# EAGLE schematic ESC-stub (EAGLE 6.1)
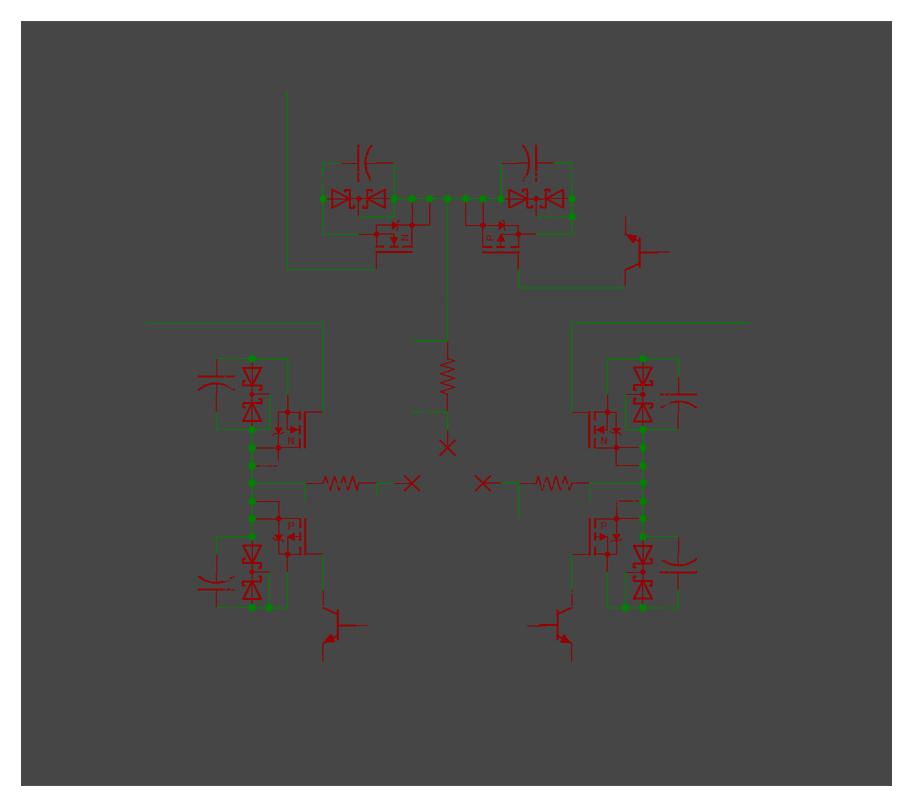
[diagram p0: schematic, sheet 1]

## Parts
C9  C-USC0402K  [C0402K]
C10  C-USC0402K  [C0402K]
C11  C-USC0402K  [C0402K]
C12  C-USC0402K  [C0402K]
C13  C-USC0402K  [C0402K]
C14  C-USC0402K  [C0402K]
D2  BAS40-05  [SOT23]
D3  BAS40-05  [SOT23]
D4  BAS40-05  [SOT23]
D5  BAS40-05  [SOT23]
D6  BAS40-05  [SOT23]
D7  BAS40-05  [SOT23]
PAD1  WIREPADSMD5-2,5  [5-2,5]
PAD2  WIREPADSMD5-2,5  [5-2,5]
PAD3  WIREPADSMD5-2,5  [5-2,5]
R2  R-US_R2512W  [R2512W]
R3  R-US_R2512W  [R2512W]
R4  R-US_R2512W  [R2512W]
U$14  IRF7309Q  [SO-8]
U$16  IRF7309Q  [SO-8]
U$18  IRF7309Q  [SO-8]
U$19  2PC4617  [SOT-416]
U$20  2PC4617  [SOT-416]
U$21  2PC4617  [SOT-416]

## Nets
N$19: U$14.4(P-G) U$19.P$3
N$20: U$14.2(N-G)
N$21: U$18.2(N-G)
N$22: U$16.4(P-G) U$20.P$3
N$23: U$16.2(N-G)
N$24: U$18.4(P-G) U$21.P$3
N$25: C9.2 C10.2 D2.1(A1) D2.3(C) D3.1(A1) R2.1 U$14.5(P-D$1) U$14.6(P-D$2) U$14.7(N-D$2) U$14.8(N-D$1)
N$26: PAD1.1(P) R2.2
N$27: PAD2.1(P) R3.1
N$28: PAD3.1(P) R4.2
N$29: C9.1 D2.2(A2) U$14.1(N-S)
N$30: C10.1 D3.2(A2) D3.3(C) U$14.3(P-S)
N$31: C13.1 D6.2(A2) U$18.1(N-S)
N$32: C14.1 D7.2(A2) D7.3(C) U$18.3(P-S)
N$33: C11.1 D4.2(A2) U$16.1(N-S)
N$34: C12.1 D5.2(A2) D5.3(C) U$16.3(P-S)
N$35: C13.2 C14.2 D6.1(A1) D6.3(C) D7.1(A1) R4.1 U$18.5(P-D$1) U$18.6(P-D$2) U$18.7(N-D$2) U$18.8(N-D$1)
N$36: C11.2 C12.2 D4.1(A1) D4.3(C) D5.1(A1) R3.2 U$16.5(P-D$1) U$16.6(P-D$2) U$16.7(N-D$2) U$16.8(N-D$1)
Unconnected: U$19.P$1 U$19.P$2 U$20.P$1 U$20.P$2 U$21.P$1 U$21.P$2

## Notes on the sheet
- Source
- M

## Library data of the parts
C9-C14 = rcl:C-US: CAPACITOR, American symbol
D2-D7 = diode:BAS40-05: Silicon Schottky Diodes General-purpose diode for high-speed switching
PAD1-PAD3 = wirepad:WIREPAD: Wire PAD connect wire on PCB
R2-R4 = rcl:R-US_: RESISTOR, American symbol
U$14 U$16 U$18 = IR-HEXFET:IRF7309Q: HEXFET Power MOSFET
U$19-U$21 = NXP:2PC4617: NPN transistor in a SOT416 (SC-75) plastic package. Low current (max. 150 mA) Low voltage (max. 50 V)